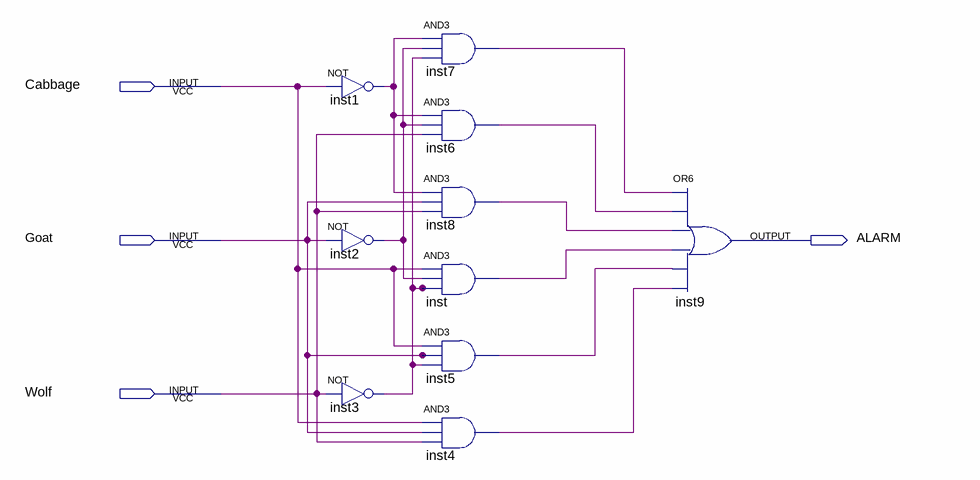
[diagram p0: schematic sheet]
// Quartus schematic lab2step2.bdf as structural Verilog: 10 symbols, 4 pins
module lab2step2 (
  input  Cabbage,
  input  Goat,
  input  Wolf,
  output ALARM
);

  wire inst1_out, inst2_out, inst3_out, inst4_out, inst5_out, inst6_out, inst7_out, inst8_out, inst_out;

  not inst1 (inst1_out, Cabbage);
  not inst2 (inst2_out, Goat);
  not inst3 (inst3_out, Wolf);
  and inst7 (inst7_out, inst1_out, inst2_out, inst3_out);
  and inst6 (inst6_out, inst1_out, inst2_out, Wolf);
  and inst8 (inst8_out, inst1_out, Goat, Wolf);
  and inst (inst_out, Cabbage, inst2_out, inst3_out);
  and inst5 (inst5_out, Cabbage, Goat, inst3_out);
  and inst4 (inst4_out, Cabbage, Goat, Wolf);
  or inst9 (ALARM, inst7_out, inst6_out, inst8_out, inst_out, inst5_out, inst4_out);
endmodule
